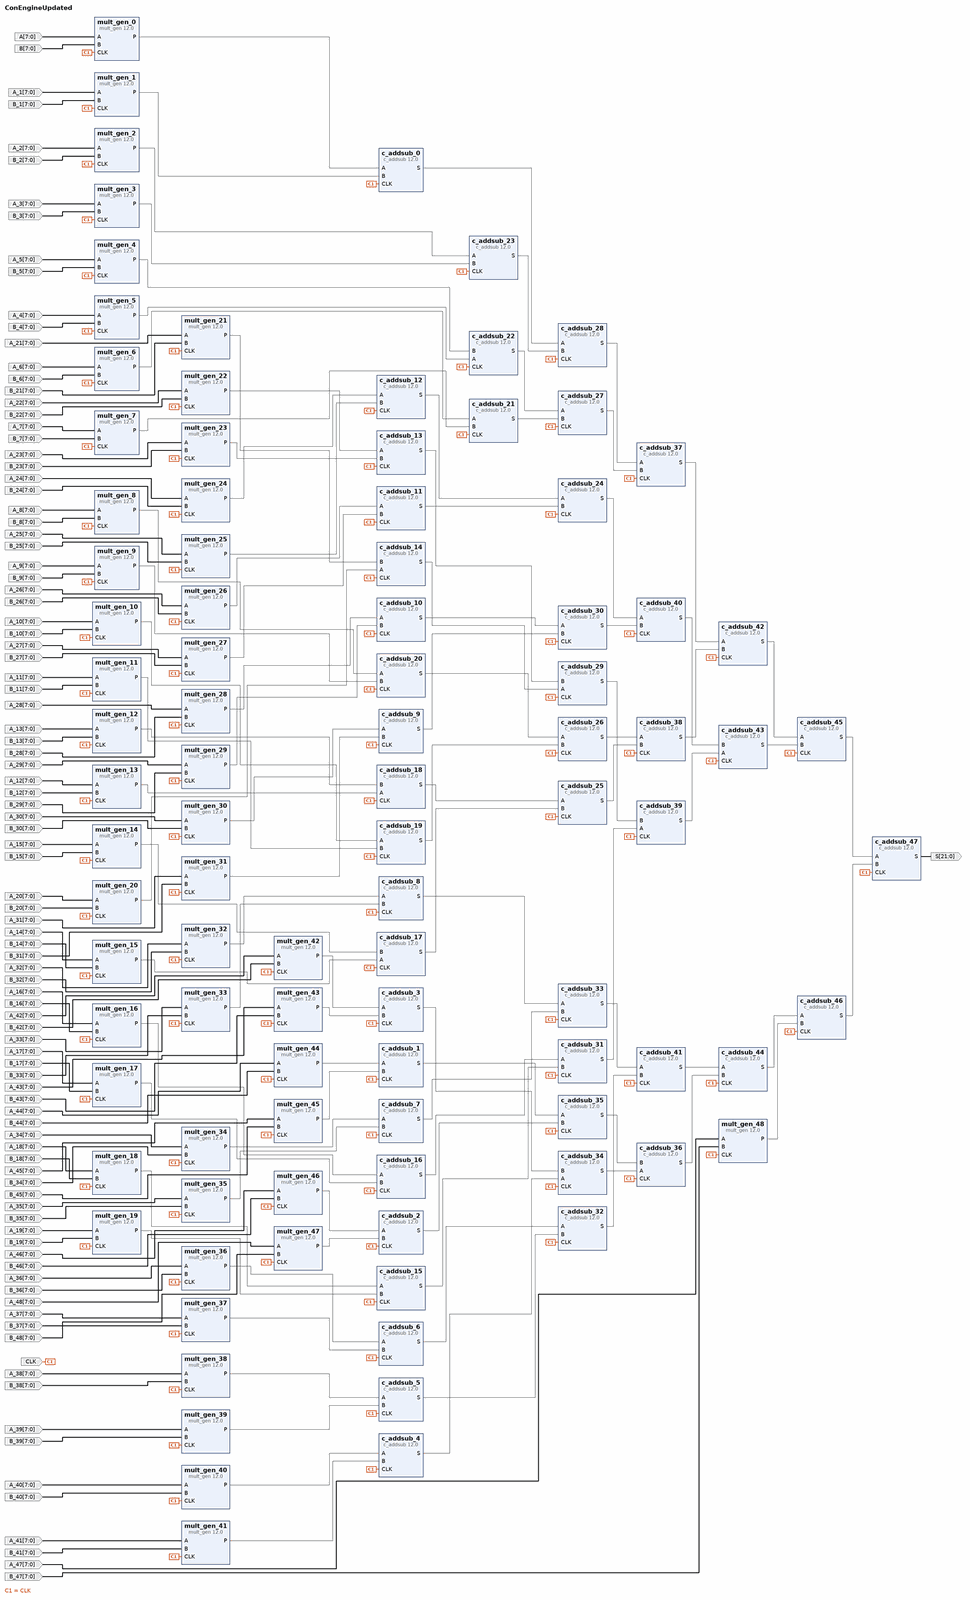
[diagram p0: block diagram of the top level, whole]
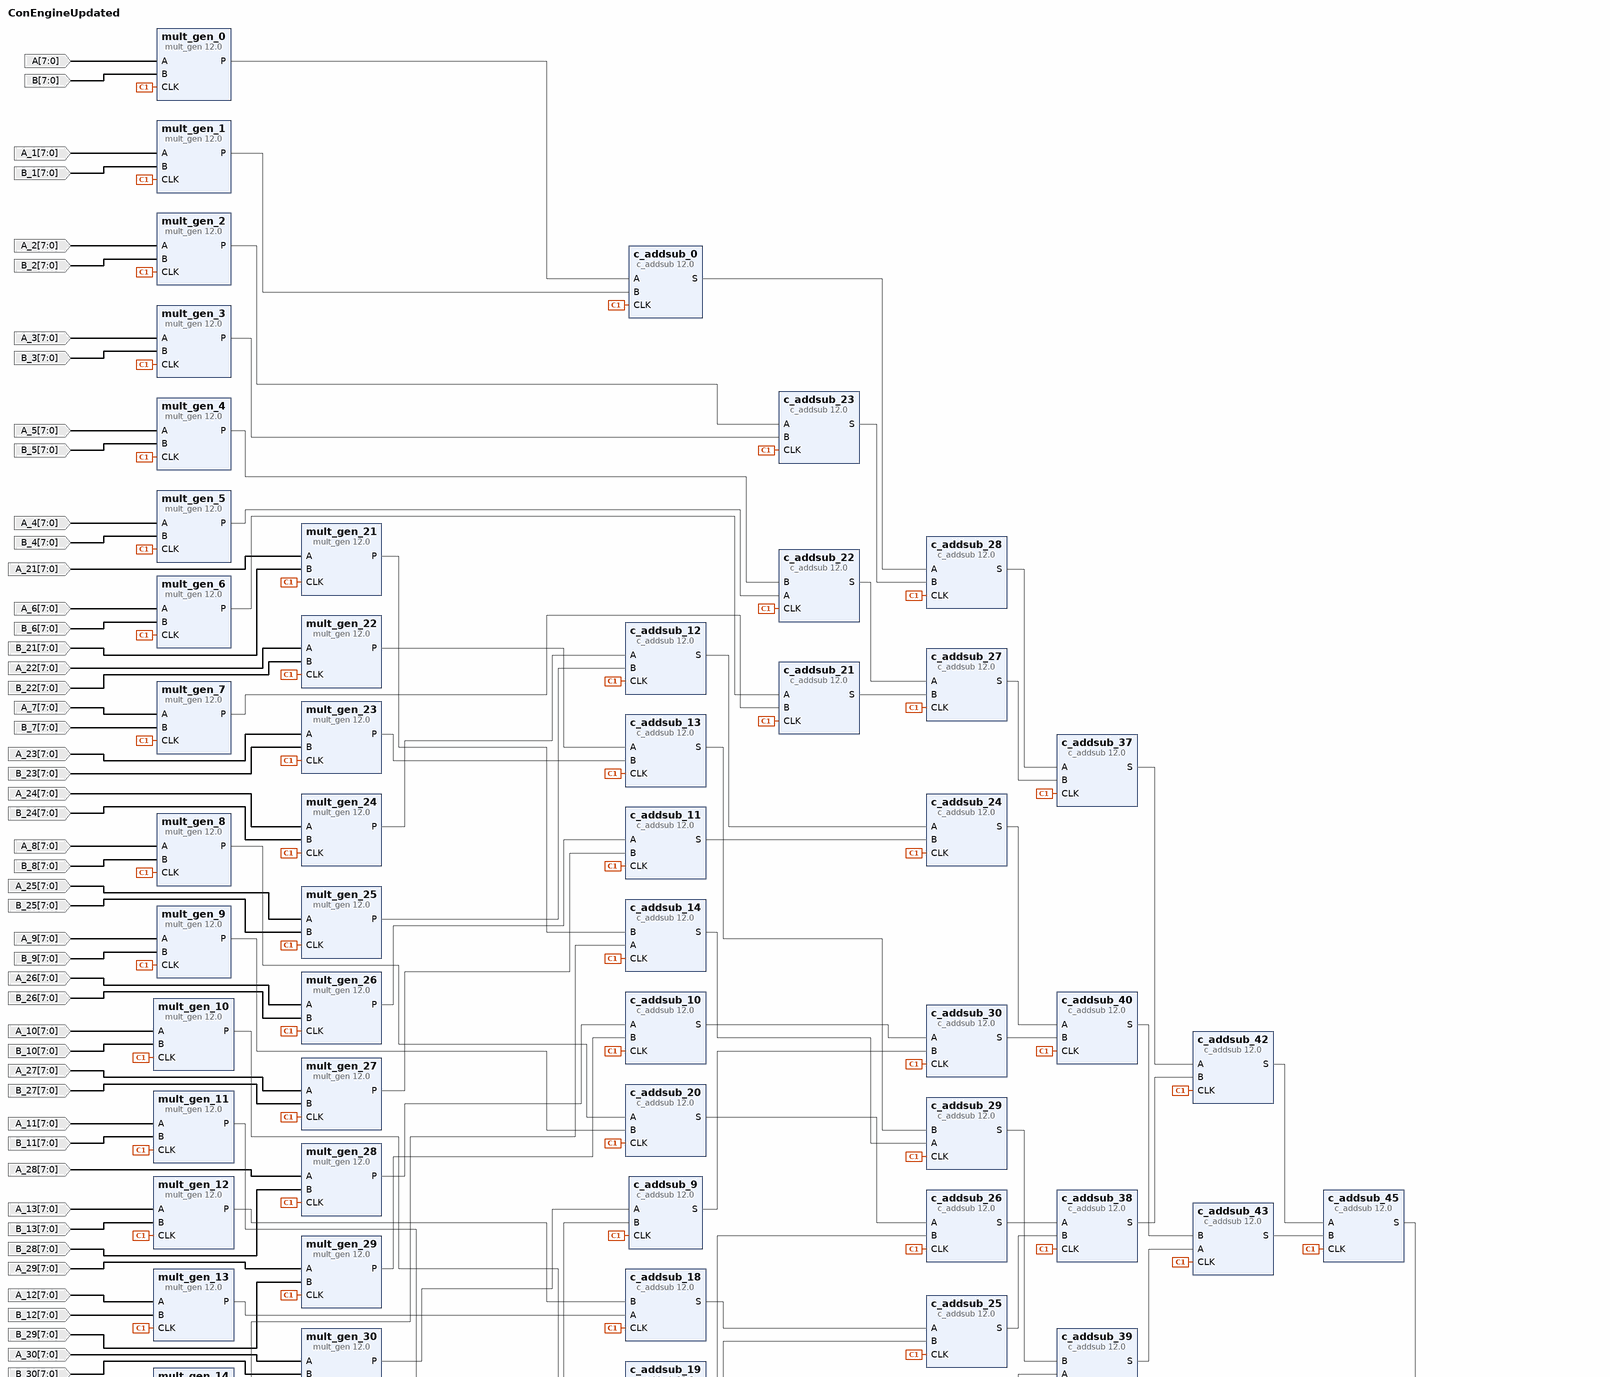
[diagram p1: block diagram of the top level, upper part]
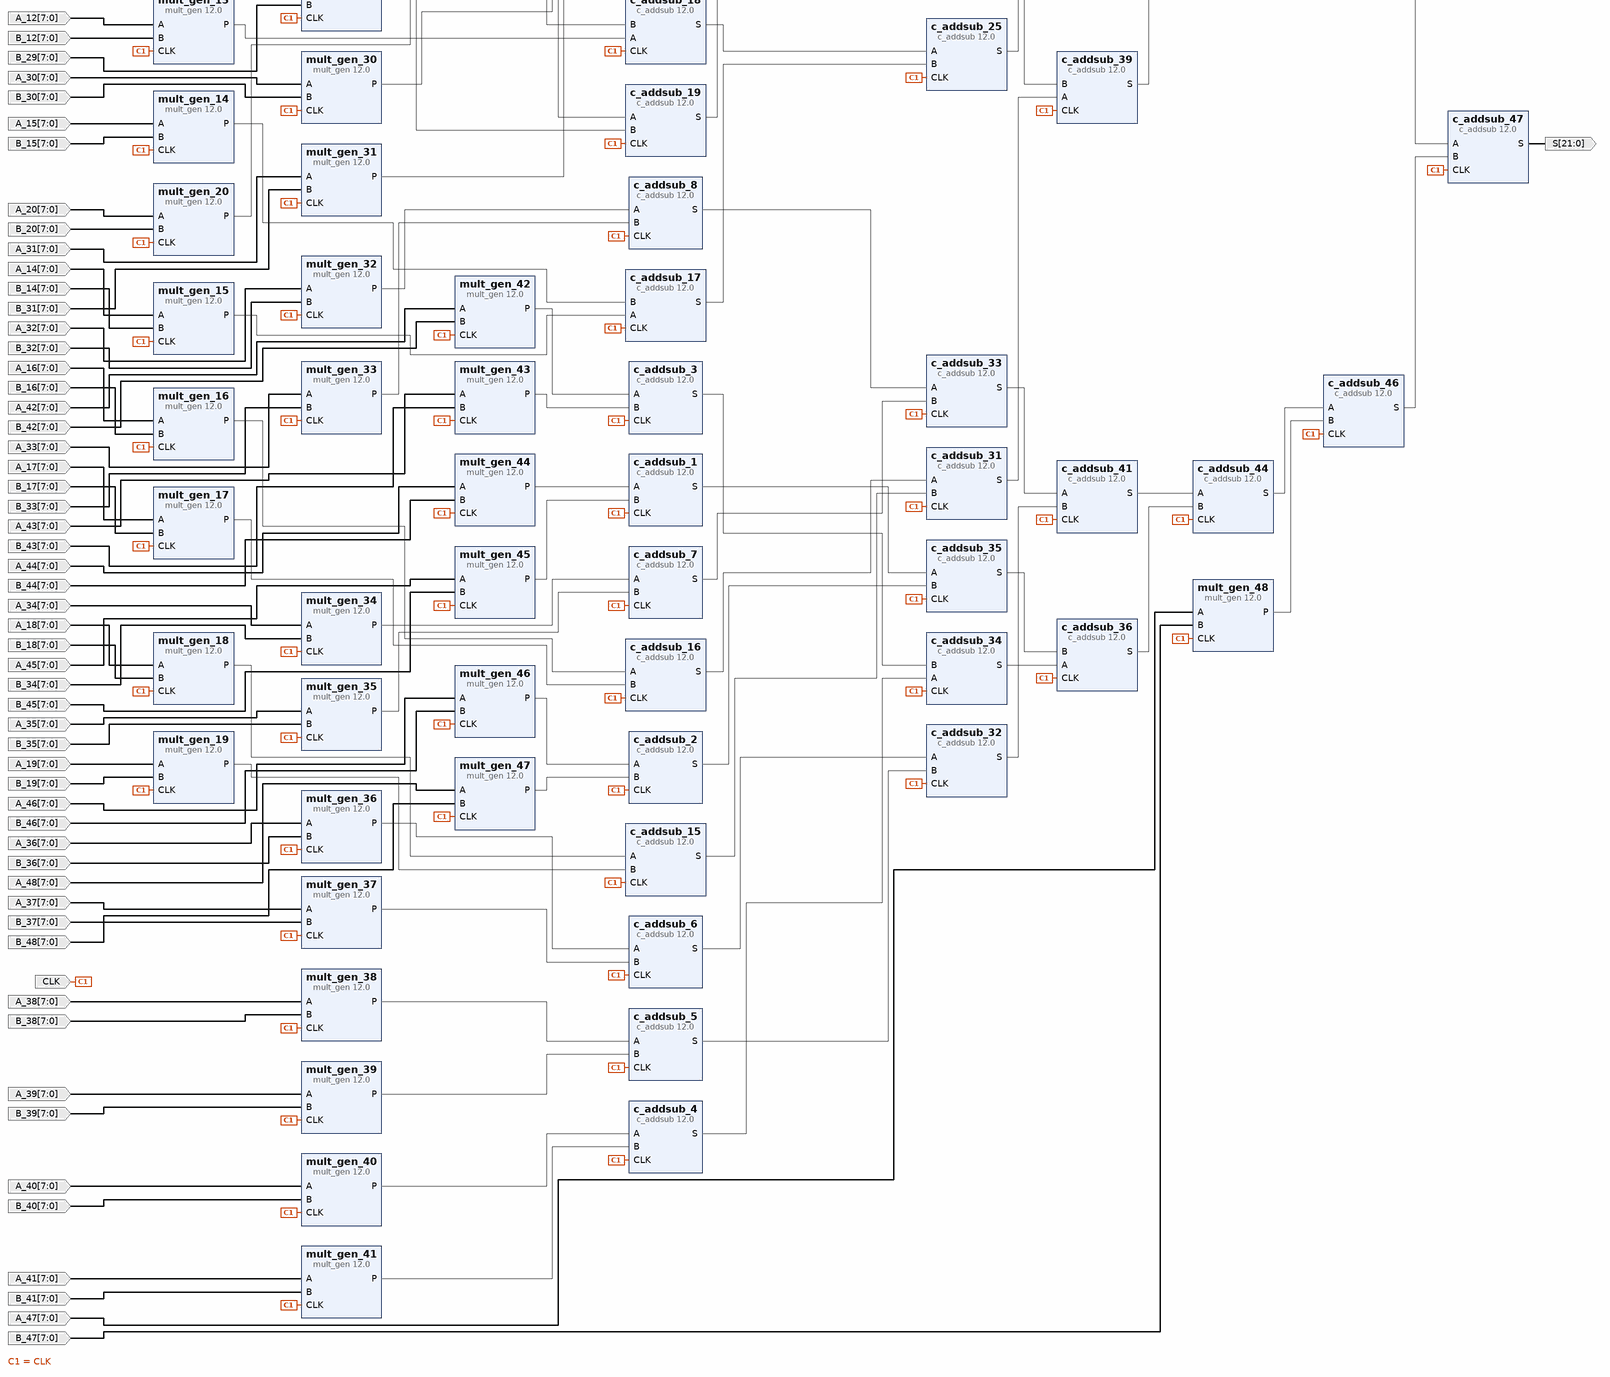
[diagram p2: block diagram of the top level, lower part]
# Vivado block design ConEngineUpdated, xc7z020clg484-1, Vivado 2016.3
create_bd_design ConEngineUpdated

create_bd_port -dir I -from 7 -to 0 -type data A
create_bd_port -dir I -from 7 -to 0 -type data B
create_bd_port -dir I -type clk CLK
set_property -dict {CONFIG.FREQ_HZ 10000000} [get_bd_ports CLK]
create_bd_port -dir I -from 7 -to 0 -type data A_1
create_bd_port -dir I -from 7 -to 0 -type data B_1
create_bd_port -dir I -from 7 -to 0 -type data A_2
create_bd_port -dir I -from 7 -to 0 -type data B_2
create_bd_port -dir I -from 7 -to 0 -type data A_3
create_bd_port -dir I -from 7 -to 0 -type data B_3
create_bd_port -dir I -from 7 -to 0 -type data A_4
create_bd_port -dir I -from 7 -to 0 -type data B_4
create_bd_port -dir I -from 7 -to 0 -type data A_5
create_bd_port -dir I -from 7 -to 0 -type data B_5
create_bd_port -dir I -from 7 -to 0 -type data A_6
create_bd_port -dir I -from 7 -to 0 -type data B_6
create_bd_port -dir I -from 7 -to 0 -type data A_7
create_bd_port -dir I -from 7 -to 0 -type data B_7
create_bd_port -dir I -from 7 -to 0 -type data A_8
create_bd_port -dir I -from 7 -to 0 -type data B_8
create_bd_port -dir I -from 7 -to 0 -type data A_9
create_bd_port -dir I -from 7 -to 0 -type data B_9
create_bd_port -dir I -from 7 -to 0 -type data A_10
create_bd_port -dir I -from 7 -to 0 -type data B_10
create_bd_port -dir I -from 7 -to 0 -type data A_11
create_bd_port -dir I -from 7 -to 0 -type data B_11
create_bd_port -dir I -from 7 -to 0 -type data A_12
create_bd_port -dir I -from 7 -to 0 -type data B_12
create_bd_port -dir I -from 7 -to 0 -type data A_13
create_bd_port -dir I -from 7 -to 0 -type data B_13
create_bd_port -dir I -from 7 -to 0 -type data A_14
create_bd_port -dir I -from 7 -to 0 -type data B_14
create_bd_port -dir I -from 7 -to 0 -type data A_15
create_bd_port -dir I -from 7 -to 0 -type data B_15
create_bd_port -dir I -from 7 -to 0 -type data A_16
create_bd_port -dir I -from 7 -to 0 -type data B_16
create_bd_port -dir I -from 7 -to 0 -type data A_17
create_bd_port -dir I -from 7 -to 0 -type data B_17
create_bd_port -dir I -from 7 -to 0 -type data A_18
create_bd_port -dir I -from 7 -to 0 -type data B_18
create_bd_port -dir I -from 7 -to 0 -type data A_19
create_bd_port -dir I -from 7 -to 0 -type data B_19
create_bd_port -dir I -from 7 -to 0 -type data A_20
create_bd_port -dir I -from 7 -to 0 -type data B_20
create_bd_port -dir I -from 7 -to 0 -type data A_21
create_bd_port -dir I -from 7 -to 0 -type data B_21
create_bd_port -dir I -from 7 -to 0 -type data A_22
create_bd_port -dir I -from 7 -to 0 -type data B_22
create_bd_port -dir I -from 7 -to 0 -type data A_23
create_bd_port -dir I -from 7 -to 0 -type data B_23
create_bd_port -dir I -from 7 -to 0 -type data A_24
create_bd_port -dir I -from 7 -to 0 -type data B_24
create_bd_port -dir I -from 7 -to 0 -type data A_25
create_bd_port -dir I -from 7 -to 0 -type data B_25
create_bd_port -dir I -from 7 -to 0 -type data A_26
create_bd_port -dir I -from 7 -to 0 -type data B_26
create_bd_port -dir I -from 7 -to 0 -type data A_27
create_bd_port -dir I -from 7 -to 0 -type data B_27
create_bd_port -dir I -from 7 -to 0 -type data A_28
create_bd_port -dir I -from 7 -to 0 -type data B_28
create_bd_port -dir I -from 7 -to 0 -type data A_29
create_bd_port -dir I -from 7 -to 0 -type data B_29
create_bd_port -dir I -from 7 -to 0 -type data A_30
create_bd_port -dir I -from 7 -to 0 -type data B_30
create_bd_port -dir I -from 7 -to 0 -type data A_31
create_bd_port -dir I -from 7 -to 0 -type data B_31
create_bd_port -dir I -from 7 -to 0 -type data A_32
create_bd_port -dir I -from 7 -to 0 -type data B_32
create_bd_port -dir I -from 7 -to 0 -type data A_33
create_bd_port -dir I -from 7 -to 0 -type data B_33
create_bd_port -dir I -from 7 -to 0 -type data A_34
create_bd_port -dir I -from 7 -to 0 -type data B_34
create_bd_port -dir I -from 7 -to 0 -type data A_35
create_bd_port -dir I -from 7 -to 0 -type data B_35
create_bd_port -dir I -from 7 -to 0 -type data A_36
create_bd_port -dir I -from 7 -to 0 -type data B_36
create_bd_port -dir I -from 7 -to 0 -type data A_37
create_bd_port -dir I -from 7 -to 0 -type data B_37
create_bd_port -dir I -from 7 -to 0 -type data A_38
create_bd_port -dir I -from 7 -to 0 -type data B_38
create_bd_port -dir I -from 7 -to 0 -type data A_39
create_bd_port -dir I -from 7 -to 0 -type data B_39
create_bd_port -dir I -from 7 -to 0 -type data A_40
create_bd_port -dir I -from 7 -to 0 -type data B_40
create_bd_port -dir I -from 7 -to 0 -type data A_41
create_bd_port -dir I -from 7 -to 0 -type data B_41
create_bd_port -dir I -from 7 -to 0 -type data A_42
create_bd_port -dir I -from 7 -to 0 -type data B_42
create_bd_port -dir I -from 7 -to 0 -type data A_43
create_bd_port -dir I -from 7 -to 0 -type data B_43
create_bd_port -dir I -from 7 -to 0 -type data A_44
create_bd_port -dir I -from 7 -to 0 -type data B_44
create_bd_port -dir I -from 7 -to 0 -type data A_45
create_bd_port -dir I -from 7 -to 0 -type data B_45
create_bd_port -dir I -from 7 -to 0 -type data A_46
create_bd_port -dir I -from 7 -to 0 -type data B_46
create_bd_port -dir I -from 7 -to 0 -type data A_47
create_bd_port -dir I -from 7 -to 0 -type data B_47
create_bd_port -dir O -from 21 -to 0 -type data S
create_bd_port -dir I -from 7 -to 0 -type data A_48
create_bd_port -dir I -from 7 -to 0 -type data B_48

create_bd_cell -type ip -vlnv xilinx.com:ip:mult_gen:12.0 mult_gen_0
set_property -dict {CONFIG.PortAWidth 8 CONFIG.PortBWidth 8 CONFIG.Multiplier_Construction Use_Mults} [get_bd_cells mult_gen_0]
create_bd_cell -type ip -vlnv xilinx.com:ip:mult_gen:12.0 mult_gen_1
set_property -dict {CONFIG.PortAWidth 8 CONFIG.PortBWidth 8 CONFIG.Multiplier_Construction Use_Mults} [get_bd_cells mult_gen_1]
create_bd_cell -type ip -vlnv xilinx.com:ip:mult_gen:12.0 mult_gen_2
set_property -dict {CONFIG.PortAWidth 8 CONFIG.PortBWidth 8 CONFIG.Multiplier_Construction Use_Mults} [get_bd_cells mult_gen_2]
create_bd_cell -type ip -vlnv xilinx.com:ip:mult_gen:12.0 mult_gen_3
set_property -dict {CONFIG.PortAWidth 8 CONFIG.PortBWidth 8 CONFIG.Multiplier_Construction Use_Mults} [get_bd_cells mult_gen_3]
create_bd_cell -type ip -vlnv xilinx.com:ip:mult_gen:12.0 mult_gen_4
set_property -dict {CONFIG.PortAWidth 8 CONFIG.PortBWidth 8 CONFIG.Multiplier_Construction Use_Mults} [get_bd_cells mult_gen_4]
create_bd_cell -type ip -vlnv xilinx.com:ip:mult_gen:12.0 mult_gen_5
set_property -dict {CONFIG.PortAWidth 8 CONFIG.PortBWidth 8 CONFIG.Multiplier_Construction Use_Mults} [get_bd_cells mult_gen_5]
create_bd_cell -type ip -vlnv xilinx.com:ip:mult_gen:12.0 mult_gen_6
set_property -dict {CONFIG.PortAWidth 8 CONFIG.PortBWidth 8 CONFIG.Multiplier_Construction Use_Mults} [get_bd_cells mult_gen_6]
create_bd_cell -type ip -vlnv xilinx.com:ip:mult_gen:12.0 mult_gen_7
set_property -dict {CONFIG.PortAWidth 8 CONFIG.PortBWidth 8 CONFIG.Multiplier_Construction Use_Mults} [get_bd_cells mult_gen_7]
create_bd_cell -type ip -vlnv xilinx.com:ip:mult_gen:12.0 mult_gen_8
set_property -dict {CONFIG.PortAWidth 8 CONFIG.PortBWidth 8 CONFIG.Multiplier_Construction Use_Mults} [get_bd_cells mult_gen_8]
create_bd_cell -type ip -vlnv xilinx.com:ip:mult_gen:12.0 mult_gen_9
set_property -dict {CONFIG.PortAWidth 8 CONFIG.PortBWidth 8 CONFIG.Multiplier_Construction Use_Mults} [get_bd_cells mult_gen_9]
create_bd_cell -type ip -vlnv xilinx.com:ip:mult_gen:12.0 mult_gen_10
set_property -dict {CONFIG.PortAWidth 8 CONFIG.PortBWidth 8 CONFIG.Multiplier_Construction Use_Mults} [get_bd_cells mult_gen_10]
create_bd_cell -type ip -vlnv xilinx.com:ip:mult_gen:12.0 mult_gen_11
set_property -dict {CONFIG.PortAWidth 8 CONFIG.PortBWidth 8 CONFIG.Multiplier_Construction Use_Mults} [get_bd_cells mult_gen_11]
create_bd_cell -type ip -vlnv xilinx.com:ip:mult_gen:12.0 mult_gen_12
set_property -dict {CONFIG.PortAWidth 8 CONFIG.PortBWidth 8 CONFIG.Multiplier_Construction Use_Mults} [get_bd_cells mult_gen_12]
create_bd_cell -type ip -vlnv xilinx.com:ip:mult_gen:12.0 mult_gen_13
set_property -dict {CONFIG.PortAWidth 8 CONFIG.PortBWidth 8 CONFIG.Multiplier_Construction Use_Mults} [get_bd_cells mult_gen_13]
create_bd_cell -type ip -vlnv xilinx.com:ip:mult_gen:12.0 mult_gen_14
set_property -dict {CONFIG.PortAWidth 8 CONFIG.PortBWidth 8 CONFIG.Multiplier_Construction Use_Mults} [get_bd_cells mult_gen_14]
create_bd_cell -type ip -vlnv xilinx.com:ip:mult_gen:12.0 mult_gen_15
set_property -dict {CONFIG.PortAWidth 8 CONFIG.PortBWidth 8 CONFIG.Multiplier_Construction Use_Mults} [get_bd_cells mult_gen_15]
create_bd_cell -type ip -vlnv xilinx.com:ip:mult_gen:12.0 mult_gen_16
set_property -dict {CONFIG.PortAWidth 8 CONFIG.PortBWidth 8 CONFIG.Multiplier_Construction Use_Mults} [get_bd_cells mult_gen_16]
create_bd_cell -type ip -vlnv xilinx.com:ip:mult_gen:12.0 mult_gen_17
set_property -dict {CONFIG.PortAWidth 8 CONFIG.PortBWidth 8 CONFIG.Multiplier_Construction Use_Mults} [get_bd_cells mult_gen_17]
create_bd_cell -type ip -vlnv xilinx.com:ip:mult_gen:12.0 mult_gen_18
set_property -dict {CONFIG.PortAWidth 8 CONFIG.PortBWidth 8 CONFIG.Multiplier_Construction Use_Mults} [get_bd_cells mult_gen_18]
create_bd_cell -type ip -vlnv xilinx.com:ip:mult_gen:12.0 mult_gen_19
set_property -dict {CONFIG.PortAWidth 8 CONFIG.PortBWidth 8 CONFIG.Multiplier_Construction Use_Mults} [get_bd_cells mult_gen_19]
create_bd_cell -type ip -vlnv xilinx.com:ip:mult_gen:12.0 mult_gen_20
set_property -dict {CONFIG.PortAWidth 8 CONFIG.PortBWidth 8 CONFIG.Multiplier_Construction Use_Mults} [get_bd_cells mult_gen_20]
create_bd_cell -type ip -vlnv xilinx.com:ip:mult_gen:12.0 mult_gen_21
set_property -dict {CONFIG.PortAWidth 8 CONFIG.PortBWidth 8 CONFIG.Multiplier_Construction Use_Mults} [get_bd_cells mult_gen_21]
create_bd_cell -type ip -vlnv xilinx.com:ip:mult_gen:12.0 mult_gen_22
set_property -dict {CONFIG.PortAWidth 8 CONFIG.PortBWidth 8 CONFIG.Multiplier_Construction Use_Mults} [get_bd_cells mult_gen_22]
create_bd_cell -type ip -vlnv xilinx.com:ip:mult_gen:12.0 mult_gen_23
set_property -dict {CONFIG.PortAWidth 8 CONFIG.PortBWidth 8 CONFIG.Multiplier_Construction Use_Mults} [get_bd_cells mult_gen_23]
create_bd_cell -type ip -vlnv xilinx.com:ip:mult_gen:12.0 mult_gen_24
set_property -dict {CONFIG.PortAWidth 8 CONFIG.PortBWidth 8 CONFIG.Multiplier_Construction Use_Mults} [get_bd_cells mult_gen_24]
create_bd_cell -type ip -vlnv xilinx.com:ip:mult_gen:12.0 mult_gen_25
set_property -dict {CONFIG.PortAWidth 8 CONFIG.PortBWidth 8 CONFIG.Multiplier_Construction Use_Mults} [get_bd_cells mult_gen_25]
create_bd_cell -type ip -vlnv xilinx.com:ip:mult_gen:12.0 mult_gen_26
set_property -dict {CONFIG.PortAWidth 8 CONFIG.PortBWidth 8 CONFIG.Multiplier_Construction Use_Mults} [get_bd_cells mult_gen_26]
create_bd_cell -type ip -vlnv xilinx.com:ip:mult_gen:12.0 mult_gen_27
set_property -dict {CONFIG.PortAWidth 8 CONFIG.PortBWidth 8 CONFIG.Multiplier_Construction Use_Mults} [get_bd_cells mult_gen_27]
create_bd_cell -type ip -vlnv xilinx.com:ip:mult_gen:12.0 mult_gen_28
set_property -dict {CONFIG.PortAWidth 8 CONFIG.PortBWidth 8 CONFIG.Multiplier_Construction Use_Mults} [get_bd_cells mult_gen_28]
create_bd_cell -type ip -vlnv xilinx.com:ip:mult_gen:12.0 mult_gen_29
set_property -dict {CONFIG.PortAWidth 8 CONFIG.PortBWidth 8 CONFIG.Multiplier_Construction Use_Mults} [get_bd_cells mult_gen_29]
create_bd_cell -type ip -vlnv xilinx.com:ip:mult_gen:12.0 mult_gen_30
set_property -dict {CONFIG.PortAWidth 8 CONFIG.PortBWidth 8 CONFIG.Multiplier_Construction Use_Mults} [get_bd_cells mult_gen_30]
create_bd_cell -type ip -vlnv xilinx.com:ip:mult_gen:12.0 mult_gen_31
set_property -dict {CONFIG.PortAWidth 8 CONFIG.PortBWidth 8 CONFIG.Multiplier_Construction Use_Mults} [get_bd_cells mult_gen_31]
create_bd_cell -type ip -vlnv xilinx.com:ip:mult_gen:12.0 mult_gen_32
set_property -dict {CONFIG.PortAWidth 8 CONFIG.PortBWidth 8 CONFIG.Multiplier_Construction Use_Mults} [get_bd_cells mult_gen_32]
create_bd_cell -type ip -vlnv xilinx.com:ip:mult_gen:12.0 mult_gen_33
set_property -dict {CONFIG.PortAWidth 8 CONFIG.PortBWidth 8 CONFIG.Multiplier_Construction Use_Mults} [get_bd_cells mult_gen_33]
create_bd_cell -type ip -vlnv xilinx.com:ip:mult_gen:12.0 mult_gen_34
set_property -dict {CONFIG.PortAWidth 8 CONFIG.PortBWidth 8 CONFIG.Multiplier_Construction Use_Mults} [get_bd_cells mult_gen_34]
create_bd_cell -type ip -vlnv xilinx.com:ip:mult_gen:12.0 mult_gen_35
set_property -dict {CONFIG.PortAWidth 8 CONFIG.PortBWidth 8 CONFIG.Multiplier_Construction Use_Mults} [get_bd_cells mult_gen_35]
create_bd_cell -type ip -vlnv xilinx.com:ip:mult_gen:12.0 mult_gen_36
set_property -dict {CONFIG.PortAWidth 8 CONFIG.PortBWidth 8 CONFIG.Multiplier_Construction Use_Mults} [get_bd_cells mult_gen_36]
create_bd_cell -type ip -vlnv xilinx.com:ip:mult_gen:12.0 mult_gen_37
set_property -dict {CONFIG.PortAWidth 8 CONFIG.PortBWidth 8 CONFIG.Multiplier_Construction Use_Mults} [get_bd_cells mult_gen_37]
create_bd_cell -type ip -vlnv xilinx.com:ip:mult_gen:12.0 mult_gen_38
set_property -dict {CONFIG.PortAWidth 8 CONFIG.PortBWidth 8 CONFIG.Multiplier_Construction Use_Mults} [get_bd_cells mult_gen_38]
create_bd_cell -type ip -vlnv xilinx.com:ip:mult_gen:12.0 mult_gen_39
set_property -dict {CONFIG.PortAWidth 8 CONFIG.PortBWidth 8 CONFIG.Multiplier_Construction Use_Mults} [get_bd_cells mult_gen_39]
create_bd_cell -type ip -vlnv xilinx.com:ip:mult_gen:12.0 mult_gen_40
set_property -dict {CONFIG.PortAWidth 8 CONFIG.PortBWidth 8 CONFIG.Multiplier_Construction Use_Mults} [get_bd_cells mult_gen_40]
create_bd_cell -type ip -vlnv xilinx.com:ip:mult_gen:12.0 mult_gen_41
set_property -dict {CONFIG.PortAWidth 8 CONFIG.PortBWidth 8 CONFIG.Multiplier_Construction Use_Mults} [get_bd_cells mult_gen_41]
create_bd_cell -type ip -vlnv xilinx.com:ip:mult_gen:12.0 mult_gen_42
set_property -dict {CONFIG.PortAWidth 8 CONFIG.PortBWidth 8 CONFIG.Multiplier_Construction Use_Mults} [get_bd_cells mult_gen_42]
create_bd_cell -type ip -vlnv xilinx.com:ip:mult_gen:12.0 mult_gen_43
set_property -dict {CONFIG.PortAWidth 8 CONFIG.PortBWidth 8 CONFIG.Multiplier_Construction Use_Mults} [get_bd_cells mult_gen_43]
create_bd_cell -type ip -vlnv xilinx.com:ip:mult_gen:12.0 mult_gen_44
set_property -dict {CONFIG.PortAWidth 8 CONFIG.PortBWidth 8 CONFIG.Multiplier_Construction Use_Mults} [get_bd_cells mult_gen_44]
create_bd_cell -type ip -vlnv xilinx.com:ip:mult_gen:12.0 mult_gen_45
set_property -dict {CONFIG.PortAWidth 8 CONFIG.PortBWidth 8 CONFIG.Multiplier_Construction Use_Mults} [get_bd_cells mult_gen_45]
create_bd_cell -type ip -vlnv xilinx.com:ip:mult_gen:12.0 mult_gen_46
set_property -dict {CONFIG.PortAWidth 8 CONFIG.PortBWidth 8 CONFIG.Multiplier_Construction Use_Mults} [get_bd_cells mult_gen_46]
create_bd_cell -type ip -vlnv xilinx.com:ip:mult_gen:12.0 mult_gen_47
set_property -dict {CONFIG.PortAWidth 8 CONFIG.PortBWidth 8 CONFIG.Multiplier_Construction Use_Mults} [get_bd_cells mult_gen_47]
create_bd_cell -type ip -vlnv xilinx.com:ip:mult_gen:12.0 mult_gen_48
set_property -dict {CONFIG.PortAWidth 8 CONFIG.PortBWidth 8 CONFIG.Multiplier_Construction Use_Mults} [get_bd_cells mult_gen_48]
create_bd_cell -type ip -vlnv xilinx.com:ip:c_addsub:12.0 c_addsub_0
set_property -dict [list \
  CONFIG.A_Width 16 \
  CONFIG.B_Width 16 \
  CONFIG.Out_Width 17 \
  CONFIG.Latency 1 \
  CONFIG.B_Value 0000000000000000 \
  CONFIG.CE false \
] [get_bd_cells c_addsub_0]
create_bd_cell -type ip -vlnv xilinx.com:ip:c_addsub:12.0 c_addsub_1
set_property -dict [list \
  CONFIG.A_Width 16 \
  CONFIG.B_Width 16 \
  CONFIG.Out_Width 17 \
  CONFIG.Latency 1 \
  CONFIG.B_Value 0000000000000000 \
  CONFIG.CE false \
] [get_bd_cells c_addsub_1]
create_bd_cell -type ip -vlnv xilinx.com:ip:c_addsub:12.0 c_addsub_2
set_property -dict [list \
  CONFIG.A_Width 16 \
  CONFIG.B_Width 16 \
  CONFIG.Out_Width 17 \
  CONFIG.Latency 1 \
  CONFIG.B_Value 0000000000000000 \
  CONFIG.CE false \
] [get_bd_cells c_addsub_2]
create_bd_cell -type ip -vlnv xilinx.com:ip:c_addsub:12.0 c_addsub_3
set_property -dict [list \
  CONFIG.A_Width 16 \
  CONFIG.B_Width 16 \
  CONFIG.Out_Width 17 \
  CONFIG.Latency 1 \
  CONFIG.B_Value 0000000000000000 \
  CONFIG.CE false \
] [get_bd_cells c_addsub_3]
create_bd_cell -type ip -vlnv xilinx.com:ip:c_addsub:12.0 c_addsub_4
set_property -dict [list \
  CONFIG.A_Width 16 \
  CONFIG.B_Width 16 \
  CONFIG.Out_Width 17 \
  CONFIG.Latency 1 \
  CONFIG.B_Value 0000000000000000 \
  CONFIG.CE false \
] [get_bd_cells c_addsub_4]
create_bd_cell -type ip -vlnv xilinx.com:ip:c_addsub:12.0 c_addsub_5
set_property -dict [list \
  CONFIG.A_Width 16 \
  CONFIG.B_Width 16 \
  CONFIG.Out_Width 17 \
  CONFIG.Latency 1 \
  CONFIG.B_Value 0000000000000000 \
  CONFIG.CE false \
] [get_bd_cells c_addsub_5]
create_bd_cell -type ip -vlnv xilinx.com:ip:c_addsub:12.0 c_addsub_6
set_property -dict [list \
  CONFIG.A_Width 16 \
  CONFIG.B_Width 16 \
  CONFIG.Out_Width 17 \
  CONFIG.Latency 1 \
  CONFIG.B_Value 0000000000000000 \
  CONFIG.CE false \
] [get_bd_cells c_addsub_6]
create_bd_cell -type ip -vlnv xilinx.com:ip:c_addsub:12.0 c_addsub_7
set_property -dict [list \
  CONFIG.A_Width 16 \
  CONFIG.B_Width 16 \
  CONFIG.Out_Width 17 \
  CONFIG.Latency 1 \
  CONFIG.B_Value 0000000000000000 \
  CONFIG.CE false \
] [get_bd_cells c_addsub_7]
create_bd_cell -type ip -vlnv xilinx.com:ip:c_addsub:12.0 c_addsub_8
set_property -dict [list \
  CONFIG.A_Width 16 \
  CONFIG.B_Width 16 \
  CONFIG.Out_Width 17 \
  CONFIG.Latency 1 \
  CONFIG.B_Value 0000000000000000 \
  CONFIG.CE false \
] [get_bd_cells c_addsub_8]
create_bd_cell -type ip -vlnv xilinx.com:ip:c_addsub:12.0 c_addsub_9
set_property -dict [list \
  CONFIG.A_Width 16 \
  CONFIG.B_Width 16 \
  CONFIG.Out_Width 17 \
  CONFIG.Latency 1 \
  CONFIG.B_Value 0000000000000000 \
  CONFIG.CE false \
] [get_bd_cells c_addsub_9]
create_bd_cell -type ip -vlnv xilinx.com:ip:c_addsub:12.0 c_addsub_10
set_property -dict [list \
  CONFIG.A_Width 16 \
  CONFIG.B_Width 16 \
  CONFIG.Out_Width 17 \
  CONFIG.Latency 1 \
  CONFIG.B_Value 0000000000000000 \
  CONFIG.CE false \
] [get_bd_cells c_addsub_10]
create_bd_cell -type ip -vlnv xilinx.com:ip:c_addsub:12.0 c_addsub_11
set_property -dict [list \
  CONFIG.A_Width 16 \
  CONFIG.B_Width 16 \
  CONFIG.Out_Width 17 \
  CONFIG.Latency 1 \
  CONFIG.B_Value 0000000000000000 \
  CONFIG.CE false \
] [get_bd_cells c_addsub_11]
create_bd_cell -type ip -vlnv xilinx.com:ip:c_addsub:12.0 c_addsub_12
set_property -dict [list \
  CONFIG.A_Width 16 \
  CONFIG.B_Width 16 \
  CONFIG.Out_Width 17 \
  CONFIG.Latency 1 \
  CONFIG.B_Value 0000000000000000 \
  CONFIG.CE false \
] [get_bd_cells c_addsub_12]
create_bd_cell -type ip -vlnv xilinx.com:ip:c_addsub:12.0 c_addsub_13
set_property -dict [list \
  CONFIG.A_Width 16 \
  CONFIG.B_Width 16 \
  CONFIG.Out_Width 17 \
  CONFIG.Latency 1 \
  CONFIG.B_Value 0000000000000000 \
  CONFIG.CE false \
] [get_bd_cells c_addsub_13]
create_bd_cell -type ip -vlnv xilinx.com:ip:c_addsub:12.0 c_addsub_14
set_property -dict [list \
  CONFIG.A_Width 16 \
  CONFIG.B_Width 16 \
  CONFIG.Out_Width 17 \
  CONFIG.Latency 1 \
  CONFIG.B_Value 0000000000000000 \
  CONFIG.CE false \
] [get_bd_cells c_addsub_14]
create_bd_cell -type ip -vlnv xilinx.com:ip:c_addsub:12.0 c_addsub_15
set_property -dict [list \
  CONFIG.A_Width 16 \
  CONFIG.B_Width 16 \
  CONFIG.Out_Width 17 \
  CONFIG.Latency 1 \
  CONFIG.B_Value 0000000000000000 \
  CONFIG.CE false \
] [get_bd_cells c_addsub_15]
create_bd_cell -type ip -vlnv xilinx.com:ip:c_addsub:12.0 c_addsub_16
set_property -dict [list \
  CONFIG.A_Width 16 \
  CONFIG.B_Width 16 \
  CONFIG.Out_Width 17 \
  CONFIG.Latency 1 \
  CONFIG.B_Value 0000000000000000 \
  CONFIG.CE false \
] [get_bd_cells c_addsub_16]
create_bd_cell -type ip -vlnv xilinx.com:ip:c_addsub:12.0 c_addsub_17
set_property -dict [list \
  CONFIG.A_Width 16 \
  CONFIG.B_Width 16 \
  CONFIG.Out_Width 17 \
  CONFIG.Latency 1 \
  CONFIG.B_Value 0000000000000000 \
  CONFIG.CE false \
] [get_bd_cells c_addsub_17]
create_bd_cell -type ip -vlnv xilinx.com:ip:c_addsub:12.0 c_addsub_18
set_property -dict [list \
  CONFIG.A_Width 16 \
  CONFIG.B_Width 16 \
  CONFIG.Out_Width 17 \
  CONFIG.Latency 1 \
  CONFIG.B_Value 0000000000000000 \
  CONFIG.CE false \
] [get_bd_cells c_addsub_18]
create_bd_cell -type ip -vlnv xilinx.com:ip:c_addsub:12.0 c_addsub_19
set_property -dict [list \
  CONFIG.A_Width 16 \
  CONFIG.B_Width 16 \
  CONFIG.Out_Width 17 \
  CONFIG.Latency 1 \
  CONFIG.B_Value 0000000000000000 \
  CONFIG.CE false \
] [get_bd_cells c_addsub_19]
create_bd_cell -type ip -vlnv xilinx.com:ip:c_addsub:12.0 c_addsub_20
set_property -dict [list \
  CONFIG.A_Width 16 \
  CONFIG.B_Width 16 \
  CONFIG.Out_Width 17 \
  CONFIG.Latency 1 \
  CONFIG.B_Value 0000000000000000 \
  CONFIG.CE false \
] [get_bd_cells c_addsub_20]
create_bd_cell -type ip -vlnv xilinx.com:ip:c_addsub:12.0 c_addsub_21
set_property -dict [list \
  CONFIG.A_Width 16 \
  CONFIG.B_Width 16 \
  CONFIG.Out_Width 17 \
  CONFIG.Latency 1 \
  CONFIG.B_Value 0000000000000000 \
  CONFIG.CE false \
] [get_bd_cells c_addsub_21]
create_bd_cell -type ip -vlnv xilinx.com:ip:c_addsub:12.0 c_addsub_22
set_property -dict [list \
  CONFIG.A_Width 16 \
  CONFIG.B_Width 16 \
  CONFIG.Out_Width 17 \
  CONFIG.Latency 1 \
  CONFIG.B_Value 0000000000000000 \
  CONFIG.CE false \
] [get_bd_cells c_addsub_22]
create_bd_cell -type ip -vlnv xilinx.com:ip:c_addsub:12.0 c_addsub_23
set_property -dict [list \
  CONFIG.A_Width 16 \
  CONFIG.B_Width 16 \
  CONFIG.Out_Width 17 \
  CONFIG.Latency 1 \
  CONFIG.B_Value 0000000000000000 \
  CONFIG.CE false \
] [get_bd_cells c_addsub_23]
create_bd_cell -type ip -vlnv xilinx.com:ip:c_addsub:12.0 c_addsub_24
set_property -dict [list \
  CONFIG.A_Width 17 \
  CONFIG.B_Width 17 \
  CONFIG.Out_Width 18 \
  CONFIG.Latency 1 \
  CONFIG.B_Value 00000000000000000 \
  CONFIG.CE false \
] [get_bd_cells c_addsub_24]
create_bd_cell -type ip -vlnv xilinx.com:ip:c_addsub:12.0 c_addsub_25
set_property -dict [list \
  CONFIG.A_Width 17 \
  CONFIG.B_Width 17 \
  CONFIG.Out_Width 18 \
  CONFIG.Latency 1 \
  CONFIG.B_Value 00000000000000000 \
  CONFIG.CE false \
] [get_bd_cells c_addsub_25]
create_bd_cell -type ip -vlnv xilinx.com:ip:c_addsub:12.0 c_addsub_26
set_property -dict [list \
  CONFIG.A_Width 17 \
  CONFIG.B_Width 17 \
  CONFIG.Out_Width 18 \
  CONFIG.Latency 1 \
  CONFIG.B_Value 00000000000000000 \
  CONFIG.CE false \
] [get_bd_cells c_addsub_26]
create_bd_cell -type ip -vlnv xilinx.com:ip:c_addsub:12.0 c_addsub_27
set_property -dict [list \
  CONFIG.A_Width 17 \
  CONFIG.B_Width 17 \
  CONFIG.Out_Width 18 \
  CONFIG.Latency 1 \
  CONFIG.B_Value 00000000000000000 \
  CONFIG.CE false \
] [get_bd_cells c_addsub_27]
create_bd_cell -type ip -vlnv xilinx.com:ip:c_addsub:12.0 c_addsub_28
set_property -dict [list \
  CONFIG.A_Width 17 \
  CONFIG.B_Width 17 \
  CONFIG.Out_Width 18 \
  CONFIG.Latency 1 \
  CONFIG.B_Value 00000000000000000 \
  CONFIG.CE false \
] [get_bd_cells c_addsub_28]
create_bd_cell -type ip -vlnv xilinx.com:ip:c_addsub:12.0 c_addsub_29
set_property -dict [list \
  CONFIG.A_Width 17 \
  CONFIG.B_Width 17 \
  CONFIG.Out_Width 18 \
  CONFIG.Latency 1 \
  CONFIG.B_Value 00000000000000000 \
  CONFIG.CE false \
] [get_bd_cells c_addsub_29]
create_bd_cell -type ip -vlnv xilinx.com:ip:c_addsub:12.0 c_addsub_30
set_property -dict [list \
  CONFIG.A_Width 17 \
  CONFIG.B_Width 17 \
  CONFIG.Out_Width 18 \
  CONFIG.Latency 1 \
  CONFIG.B_Value 00000000000000000 \
  CONFIG.CE false \
] [get_bd_cells c_addsub_30]
create_bd_cell -type ip -vlnv xilinx.com:ip:c_addsub:12.0 c_addsub_31
set_property -dict [list \
  CONFIG.A_Width 17 \
  CONFIG.B_Width 17 \
  CONFIG.Out_Width 18 \
  CONFIG.Latency 1 \
  CONFIG.B_Value 00000000000000000 \
  CONFIG.CE false \
] [get_bd_cells c_addsub_31]
create_bd_cell -type ip -vlnv xilinx.com:ip:c_addsub:12.0 c_addsub_32
set_property -dict [list \
  CONFIG.A_Width 17 \
  CONFIG.B_Width 17 \
  CONFIG.Out_Width 18 \
  CONFIG.Latency 1 \
  CONFIG.B_Value 00000000000000000 \
  CONFIG.CE false \
] [get_bd_cells c_addsub_32]
create_bd_cell -type ip -vlnv xilinx.com:ip:c_addsub:12.0 c_addsub_33
set_property -dict [list \
  CONFIG.A_Width 17 \
  CONFIG.B_Width 17 \
  CONFIG.Out_Width 18 \
  CONFIG.Latency 1 \
  CONFIG.B_Value 00000000000000000 \
  CONFIG.CE false \
] [get_bd_cells c_addsub_33]
create_bd_cell -type ip -vlnv xilinx.com:ip:c_addsub:12.0 c_addsub_34
set_property -dict [list \
  CONFIG.A_Width 17 \
  CONFIG.B_Width 17 \
  CONFIG.Out_Width 18 \
  CONFIG.Latency 1 \
  CONFIG.B_Value 00000000000000000 \
  CONFIG.CE false \
] [get_bd_cells c_addsub_34]
create_bd_cell -type ip -vlnv xilinx.com:ip:c_addsub:12.0 c_addsub_35
set_property -dict [list \
  CONFIG.A_Width 17 \
  CONFIG.B_Width 17 \
  CONFIG.Out_Width 18 \
  CONFIG.Latency 1 \
  CONFIG.B_Value 00000000000000000 \
  CONFIG.CE false \
] [get_bd_cells c_addsub_35]
create_bd_cell -type ip -vlnv xilinx.com:ip:c_addsub:12.0 c_addsub_36
set_property -dict [list \
  CONFIG.A_Width 18 \
  CONFIG.B_Width 18 \
  CONFIG.Out_Width 19 \
  CONFIG.Latency 1 \
  CONFIG.B_Value 000000000000000000 \
  CONFIG.CE false \
] [get_bd_cells c_addsub_36]
create_bd_cell -type ip -vlnv xilinx.com:ip:c_addsub:12.0 c_addsub_37
set_property -dict [list \
  CONFIG.A_Width 18 \
  CONFIG.B_Width 18 \
  CONFIG.Out_Width 19 \
  CONFIG.Latency 1 \
  CONFIG.B_Value 000000000000000000 \
  CONFIG.CE false \
] [get_bd_cells c_addsub_37]
create_bd_cell -type ip -vlnv xilinx.com:ip:c_addsub:12.0 c_addsub_38
set_property -dict [list \
  CONFIG.A_Width 18 \
  CONFIG.B_Width 18 \
  CONFIG.Out_Width 19 \
  CONFIG.Latency 1 \
  CONFIG.B_Value 000000000000000000 \
  CONFIG.CE false \
] [get_bd_cells c_addsub_38]
create_bd_cell -type ip -vlnv xilinx.com:ip:c_addsub:12.0 c_addsub_39
set_property -dict [list \
  CONFIG.A_Width 18 \
  CONFIG.B_Width 18 \
  CONFIG.Out_Width 19 \
  CONFIG.Latency 1 \
  CONFIG.B_Value 000000000000000000 \
  CONFIG.CE false \
] [get_bd_cells c_addsub_39]
create_bd_cell -type ip -vlnv xilinx.com:ip:c_addsub:12.0 c_addsub_40
set_property -dict [list \
  CONFIG.A_Width 18 \
  CONFIG.B_Width 18 \
  CONFIG.Out_Width 19 \
  CONFIG.Latency 1 \
  CONFIG.B_Value 000000000000000000 \
  CONFIG.CE false \
] [get_bd_cells c_addsub_40]
create_bd_cell -type ip -vlnv xilinx.com:ip:c_addsub:12.0 c_addsub_41
set_property -dict [list \
  CONFIG.A_Width 18 \
  CONFIG.B_Width 18 \
  CONFIG.Out_Width 19 \
  CONFIG.Latency 1 \
  CONFIG.B_Value 000000000000000000 \
  CONFIG.CE false \
] [get_bd_cells c_addsub_41]
create_bd_cell -type ip -vlnv xilinx.com:ip:c_addsub:12.0 c_addsub_42
set_property -dict [list \
  CONFIG.A_Width 19 \
  CONFIG.B_Width 19 \
  CONFIG.Out_Width 20 \
  CONFIG.Latency 1 \
  CONFIG.B_Value 0000000000000000000 \
  CONFIG.CE false \
] [get_bd_cells c_addsub_42]
create_bd_cell -type ip -vlnv xilinx.com:ip:c_addsub:12.0 c_addsub_43
set_property -dict [list \
  CONFIG.A_Width 19 \
  CONFIG.B_Width 19 \
  CONFIG.Out_Width 20 \
  CONFIG.Latency 1 \
  CONFIG.B_Value 0000000000000000000 \
  CONFIG.CE false \
] [get_bd_cells c_addsub_43]
create_bd_cell -type ip -vlnv xilinx.com:ip:c_addsub:12.0 c_addsub_44
set_property -dict [list \
  CONFIG.A_Width 19 \
  CONFIG.B_Width 19 \
  CONFIG.Out_Width 20 \
  CONFIG.Latency 1 \
  CONFIG.B_Value 0000000000000000000 \
  CONFIG.CE false \
] [get_bd_cells c_addsub_44]
create_bd_cell -type ip -vlnv xilinx.com:ip:c_addsub:12.0 c_addsub_45
set_property -dict [list \
  CONFIG.A_Width 20 \
  CONFIG.B_Width 20 \
  CONFIG.Out_Width 21 \
  CONFIG.Latency 1 \
  CONFIG.B_Value 00000000000000000000 \
  CONFIG.CE false \
] [get_bd_cells c_addsub_45]
create_bd_cell -type ip -vlnv xilinx.com:ip:c_addsub:12.0 c_addsub_46
set_property -dict [list \
  CONFIG.A_Width 20 \
  CONFIG.B_Width 16 \
  CONFIG.Out_Width 21 \
  CONFIG.Latency 1 \
  CONFIG.B_Value 0000000000000000 \
  CONFIG.CE false \
] [get_bd_cells c_addsub_46]
create_bd_cell -type ip -vlnv xilinx.com:ip:c_addsub:12.0 c_addsub_47
set_property -dict [list \
  CONFIG.A_Width 21 \
  CONFIG.B_Width 21 \
  CONFIG.Out_Width 22 \
  CONFIG.Latency 1 \
  CONFIG.B_Value 000000000000000000000 \
  CONFIG.CE false \
] [get_bd_cells c_addsub_47]

# ---- connections ----

connect_bd_net [get_bd_pins mult_gen_0/P] [get_bd_pins c_addsub_0/A]
connect_bd_net [get_bd_pins mult_gen_1/P] [get_bd_pins c_addsub_0/B]
connect_bd_net [get_bd_pins mult_gen_2/P] [get_bd_pins c_addsub_23/A]
connect_bd_net [get_bd_pins mult_gen_3/P] [get_bd_pins c_addsub_23/B]
connect_bd_net [get_bd_pins mult_gen_5/P] [get_bd_pins c_addsub_22/A]
connect_bd_net [get_bd_pins mult_gen_4/P] [get_bd_pins c_addsub_22/B]
connect_bd_net [get_bd_pins mult_gen_6/P] [get_bd_pins c_addsub_21/A]
connect_bd_net [get_bd_pins mult_gen_7/P] [get_bd_pins c_addsub_21/B]
connect_bd_net [get_bd_pins mult_gen_8/P] [get_bd_pins c_addsub_20/A]
connect_bd_net [get_bd_pins mult_gen_9/P] [get_bd_pins c_addsub_20/B]
connect_bd_net [get_bd_pins mult_gen_10/P] [get_bd_pins c_addsub_19/A]
connect_bd_net [get_bd_pins mult_gen_11/P] [get_bd_pins c_addsub_19/B]
connect_bd_net [get_bd_pins mult_gen_13/P] [get_bd_pins c_addsub_18/A]
connect_bd_net [get_bd_pins mult_gen_12/P] [get_bd_pins c_addsub_18/B]
connect_bd_net [get_bd_pins mult_gen_15/P] [get_bd_pins c_addsub_17/A]
connect_bd_net [get_bd_pins mult_gen_14/P] [get_bd_pins c_addsub_17/B]
connect_bd_net [get_bd_pins mult_gen_16/P] [get_bd_pins c_addsub_16/A]
connect_bd_net [get_bd_pins mult_gen_17/P] [get_bd_pins c_addsub_16/B]
connect_bd_net [get_bd_pins mult_gen_18/P] [get_bd_pins c_addsub_15/A]
connect_bd_net [get_bd_pins mult_gen_19/P] [get_bd_pins c_addsub_15/B]
connect_bd_net [get_bd_pins mult_gen_20/P] [get_bd_pins c_addsub_14/A]
connect_bd_net [get_bd_pins mult_gen_21/P] [get_bd_pins c_addsub_14/B]
connect_bd_net [get_bd_pins mult_gen_22/P] [get_bd_pins c_addsub_13/A]
connect_bd_net [get_bd_pins mult_gen_23/P] [get_bd_pins c_addsub_13/B]
connect_bd_net [get_bd_pins mult_gen_24/P] [get_bd_pins c_addsub_12/A]
connect_bd_net [get_bd_pins mult_gen_25/P] [get_bd_pins c_addsub_12/B]
connect_bd_net [get_bd_pins mult_gen_26/P] [get_bd_pins c_addsub_11/A]
connect_bd_net [get_bd_pins mult_gen_27/P] [get_bd_pins c_addsub_11/B]
connect_bd_net [get_bd_pins mult_gen_28/P] [get_bd_pins c_addsub_10/A]
connect_bd_net [get_bd_pins mult_gen_29/P] [get_bd_pins c_addsub_10/B]
connect_bd_net [get_bd_pins mult_gen_30/P] [get_bd_pins c_addsub_9/A]
connect_bd_net [get_bd_pins mult_gen_31/P] [get_bd_pins c_addsub_9/B]
connect_bd_net [get_bd_pins mult_gen_32/P] [get_bd_pins c_addsub_8/A]
connect_bd_net [get_bd_pins mult_gen_33/P] [get_bd_pins c_addsub_8/B]
connect_bd_net [get_bd_pins mult_gen_34/P] [get_bd_pins c_addsub_7/A]
connect_bd_net [get_bd_pins mult_gen_35/P] [get_bd_pins c_addsub_7/B]
connect_bd_net [get_bd_pins mult_gen_36/P] [get_bd_pins c_addsub_6/A]
connect_bd_net [get_bd_pins mult_gen_37/P] [get_bd_pins c_addsub_6/B]
connect_bd_net [get_bd_pins mult_gen_38/P] [get_bd_pins c_addsub_5/A]
connect_bd_net [get_bd_pins mult_gen_39/P] [get_bd_pins c_addsub_5/B]
connect_bd_net [get_bd_pins mult_gen_40/P] [get_bd_pins c_addsub_4/A]
connect_bd_net [get_bd_pins mult_gen_41/P] [get_bd_pins c_addsub_4/B]
connect_bd_net [get_bd_pins mult_gen_42/P] [get_bd_pins c_addsub_3/A]
connect_bd_net [get_bd_pins mult_gen_43/P] [get_bd_pins c_addsub_3/B]
connect_bd_net [get_bd_pins mult_gen_44/P] [get_bd_pins c_addsub_1/A]
connect_bd_net [get_bd_pins mult_gen_45/P] [get_bd_pins c_addsub_1/B]
connect_bd_net [get_bd_pins mult_gen_46/P] [get_bd_pins c_addsub_2/A]
connect_bd_net [get_bd_pins mult_gen_47/P] [get_bd_pins c_addsub_2/B]
connect_bd_net [get_bd_pins c_addsub_0/S] [get_bd_pins c_addsub_28/A]
connect_bd_net [get_bd_pins c_addsub_23/S] [get_bd_pins c_addsub_28/B]
connect_bd_net [get_bd_pins c_addsub_22/S] [get_bd_pins c_addsub_27/A]
connect_bd_net [get_bd_pins c_addsub_21/S] [get_bd_pins c_addsub_27/B]
connect_bd_net [get_bd_pins c_addsub_20/S] [get_bd_pins c_addsub_26/A]
connect_bd_net [get_bd_pins c_addsub_19/S] [get_bd_pins c_addsub_26/B]
connect_bd_net [get_bd_pins c_addsub_18/S] [get_bd_pins c_addsub_25/A]
connect_bd_net [get_bd_pins c_addsub_17/S] [get_bd_pins c_addsub_25/B]
connect_bd_net [get_bd_pins c_addsub_16/S] [get_bd_pins c_addsub_31/A]
connect_bd_net [get_bd_pins c_addsub_15/S] [get_bd_pins c_addsub_31/B]
connect_bd_net [get_bd_pins c_addsub_14/S] [get_bd_pins c_addsub_29/A]
connect_bd_net [get_bd_pins c_addsub_13/S] [get_bd_pins c_addsub_29/B]
connect_bd_net [get_bd_pins c_addsub_12/S] [get_bd_pins c_addsub_24/A]
connect_bd_net [get_bd_pins c_addsub_11/S] [get_bd_pins c_addsub_24/B]
connect_bd_net [get_bd_pins c_addsub_10/S] [get_bd_pins c_addsub_30/A]
connect_bd_net [get_bd_pins c_addsub_9/S] [get_bd_pins c_addsub_30/B]
connect_bd_net [get_bd_pins c_addsub_8/S] [get_bd_pins c_addsub_33/A]
connect_bd_net [get_bd_pins c_addsub_7/S] [get_bd_pins c_addsub_33/B]
connect_bd_net [get_bd_pins c_addsub_6/S] [get_bd_pins c_addsub_32/A]
connect_bd_net [get_bd_pins c_addsub_5/S] [get_bd_pins c_addsub_32/B]
connect_bd_net [get_bd_pins c_addsub_4/S] [get_bd_pins c_addsub_34/A]
connect_bd_net [get_bd_pins c_addsub_3/S] [get_bd_pins c_addsub_34/B]
connect_bd_net [get_bd_pins c_addsub_1/S] [get_bd_pins c_addsub_35/A]
connect_bd_net [get_bd_pins c_addsub_2/S] [get_bd_pins c_addsub_35/B]
connect_bd_net [get_bd_pins c_addsub_28/S] [get_bd_pins c_addsub_37/A]
connect_bd_net [get_bd_pins c_addsub_27/S] [get_bd_pins c_addsub_37/B]
connect_bd_net [get_bd_pins c_addsub_26/S] [get_bd_pins c_addsub_38/A]
connect_bd_net [get_bd_pins c_addsub_25/S] [get_bd_pins c_addsub_38/B]
connect_bd_net [get_bd_pins c_addsub_31/S] [get_bd_pins c_addsub_39/A]
connect_bd_net [get_bd_pins c_addsub_29/S] [get_bd_pins c_addsub_39/B]
connect_bd_net [get_bd_pins c_addsub_24/S] [get_bd_pins c_addsub_40/A]
connect_bd_net [get_bd_pins c_addsub_30/S] [get_bd_pins c_addsub_40/B]
connect_bd_net [get_bd_pins c_addsub_33/S] [get_bd_pins c_addsub_41/A]
connect_bd_net [get_bd_pins c_addsub_32/S] [get_bd_pins c_addsub_41/B]
connect_bd_net [get_bd_pins c_addsub_34/S] [get_bd_pins c_addsub_36/A]
connect_bd_net [get_bd_pins c_addsub_35/S] [get_bd_pins c_addsub_36/B]
connect_bd_net [get_bd_pins c_addsub_37/S] [get_bd_pins c_addsub_42/A]
connect_bd_net [get_bd_pins c_addsub_38/S] [get_bd_pins c_addsub_42/B]
connect_bd_net [get_bd_pins c_addsub_39/S] [get_bd_pins c_addsub_43/A]
connect_bd_net [get_bd_pins c_addsub_40/S] [get_bd_pins c_addsub_43/B]
connect_bd_net [get_bd_pins c_addsub_41/S] [get_bd_pins c_addsub_44/A]
connect_bd_net [get_bd_pins c_addsub_36/S] [get_bd_pins c_addsub_44/B]
connect_bd_net [get_bd_pins c_addsub_42/S] [get_bd_pins c_addsub_45/A]
connect_bd_net [get_bd_pins c_addsub_43/S] [get_bd_pins c_addsub_45/B]
connect_bd_net [get_bd_pins c_addsub_44/S] [get_bd_pins c_addsub_46/A]
connect_bd_net [get_bd_pins mult_gen_48/P] [get_bd_pins c_addsub_46/B]
connect_bd_net [get_bd_pins c_addsub_45/S] [get_bd_pins c_addsub_47/A]
connect_bd_net [get_bd_pins c_addsub_46/S] [get_bd_pins c_addsub_47/B]
connect_bd_net [get_bd_ports A] [get_bd_pins mult_gen_0/A]
connect_bd_net [get_bd_ports B] [get_bd_pins mult_gen_0/B]
connect_bd_net -net A_1_1 [get_bd_ports A_1] [get_bd_pins mult_gen_1/A]
connect_bd_net -net B_1_1 [get_bd_ports B_1] [get_bd_pins mult_gen_1/B]
connect_bd_net -net A_2_1 [get_bd_ports A_2] [get_bd_pins mult_gen_2/A]
connect_bd_net -net B_2_1 [get_bd_ports B_2] [get_bd_pins mult_gen_2/B]
connect_bd_net -net A_3_1 [get_bd_ports A_3] [get_bd_pins mult_gen_3/A]
connect_bd_net -net B_3_1 [get_bd_ports B_3] [get_bd_pins mult_gen_3/B]
connect_bd_net -net A_4_1 [get_bd_ports A_4] [get_bd_pins mult_gen_5/A]
connect_bd_net -net B_4_1 [get_bd_ports B_4] [get_bd_pins mult_gen_5/B]
connect_bd_net -net A_5_1 [get_bd_ports A_5] [get_bd_pins mult_gen_4/A]
connect_bd_net -net B_5_1 [get_bd_ports B_5] [get_bd_pins mult_gen_4/B]
connect_bd_net -net A_6_1 [get_bd_ports A_6] [get_bd_pins mult_gen_6/A]
connect_bd_net -net B_6_1 [get_bd_ports B_6] [get_bd_pins mult_gen_6/B]
connect_bd_net -net A_7_1 [get_bd_ports A_7] [get_bd_pins mult_gen_7/A]
connect_bd_net -net B_7_1 [get_bd_ports B_7] [get_bd_pins mult_gen_7/B]
connect_bd_net -net A_8_1 [get_bd_ports A_8] [get_bd_pins mult_gen_8/A]
connect_bd_net -net B_8_1 [get_bd_ports B_8] [get_bd_pins mult_gen_8/B]
connect_bd_net -net A_9_1 [get_bd_ports A_9] [get_bd_pins mult_gen_9/A]
connect_bd_net -net B_9_1 [get_bd_ports B_9] [get_bd_pins mult_gen_9/B]
connect_bd_net -net A_10_1 [get_bd_ports A_10] [get_bd_pins mult_gen_10/A]
connect_bd_net -net B_10_1 [get_bd_ports B_10] [get_bd_pins mult_gen_10/B]
connect_bd_net -net A_11_1 [get_bd_ports A_11] [get_bd_pins mult_gen_11/A]
connect_bd_net -net B_11_1 [get_bd_ports B_11] [get_bd_pins mult_gen_11/B]
connect_bd_net -net A_12_1 [get_bd_ports A_12] [get_bd_pins mult_gen_13/A]
connect_bd_net -net B_12_1 [get_bd_ports B_12] [get_bd_pins mult_gen_13/B]
connect_bd_net -net A_13_1 [get_bd_ports A_13] [get_bd_pins mult_gen_12/A]
connect_bd_net -net B_13_1 [get_bd_ports B_13] [get_bd_pins mult_gen_12/B]
connect_bd_net -net A_14_1 [get_bd_ports A_14] [get_bd_pins mult_gen_15/A]
connect_bd_net -net B_14_1 [get_bd_ports B_14] [get_bd_pins mult_gen_15/B]
connect_bd_net -net A_15_1 [get_bd_ports A_15] [get_bd_pins mult_gen_14/A]
connect_bd_net -net B_15_1 [get_bd_ports B_15] [get_bd_pins mult_gen_14/B]
connect_bd_net -net A_16_1 [get_bd_ports A_16] [get_bd_pins mult_gen_16/A]
connect_bd_net -net B_16_1 [get_bd_ports B_16] [get_bd_pins mult_gen_16/B]
connect_bd_net -net A_17_1 [get_bd_ports A_17] [get_bd_pins mult_gen_17/A]
connect_bd_net -net B_17_1 [get_bd_ports B_17] [get_bd_pins mult_gen_17/B]
connect_bd_net -net A_18_1 [get_bd_ports A_18] [get_bd_pins mult_gen_18/A]
connect_bd_net -net B_18_1 [get_bd_ports B_18] [get_bd_pins mult_gen_18/B]
connect_bd_net -net A_19_1 [get_bd_ports A_19] [get_bd_pins mult_gen_19/A]
connect_bd_net -net B_19_1 [get_bd_ports B_19] [get_bd_pins mult_gen_19/B]
connect_bd_net -net A_20_1 [get_bd_ports A_20] [get_bd_pins mult_gen_20/A]
connect_bd_net -net B_20_1 [get_bd_ports B_20] [get_bd_pins mult_gen_20/B]
connect_bd_net -net A_21_1 [get_bd_ports A_21] [get_bd_pins mult_gen_21/A]
connect_bd_net -net B_21_1 [get_bd_ports B_21] [get_bd_pins mult_gen_21/B]
connect_bd_net -net A_22_1 [get_bd_ports A_22] [get_bd_pins mult_gen_22/A]
connect_bd_net -net B_22_1 [get_bd_ports B_22] [get_bd_pins mult_gen_22/B]
connect_bd_net -net A_23_1 [get_bd_ports A_23] [get_bd_pins mult_gen_23/A]
connect_bd_net -net B_23_1 [get_bd_ports B_23] [get_bd_pins mult_gen_23/B]
connect_bd_net -net A_24_1 [get_bd_ports A_24] [get_bd_pins mult_gen_24/A]
connect_bd_net -net B_24_1 [get_bd_ports B_24] [get_bd_pins mult_gen_24/B]
connect_bd_net -net A_25_1 [get_bd_ports A_25] [get_bd_pins mult_gen_25/A]
connect_bd_net -net B_25_1 [get_bd_ports B_25] [get_bd_pins mult_gen_25/B]
connect_bd_net -net A_26_1 [get_bd_ports A_26] [get_bd_pins mult_gen_26/A]
connect_bd_net -net B_26_1 [get_bd_ports B_26] [get_bd_pins mult_gen_26/B]
connect_bd_net -net A_27_1 [get_bd_ports A_27] [get_bd_pins mult_gen_27/A]
connect_bd_net -net B_27_1 [get_bd_ports B_27] [get_bd_pins mult_gen_27/B]
connect_bd_net -net A_28_1 [get_bd_ports A_28] [get_bd_pins mult_gen_28/A]
connect_bd_net -net B_28_1 [get_bd_ports B_28] [get_bd_pins mult_gen_28/B]
connect_bd_net -net A_29_1 [get_bd_ports A_29] [get_bd_pins mult_gen_29/A]
connect_bd_net -net B_29_1 [get_bd_ports B_29] [get_bd_pins mult_gen_29/B]
connect_bd_net -net A_30_1 [get_bd_ports A_30] [get_bd_pins mult_gen_30/A]
connect_bd_net -net B_30_1 [get_bd_ports B_30] [get_bd_pins mult_gen_30/B]
connect_bd_net -net A_31_1 [get_bd_ports A_31] [get_bd_pins mult_gen_31/A]
connect_bd_net -net B_31_1 [get_bd_ports B_31] [get_bd_pins mult_gen_31/B]
connect_bd_net -net A_32_1 [get_bd_ports A_32] [get_bd_pins mult_gen_32/A]
connect_bd_net -net B_32_1 [get_bd_ports B_32] [get_bd_pins mult_gen_32/B]
connect_bd_net -net A_33_1 [get_bd_ports A_33] [get_bd_pins mult_gen_33/A]
connect_bd_net -net B_33_1 [get_bd_ports B_33] [get_bd_pins mult_gen_33/B]
connect_bd_net -net A_34_1 [get_bd_ports A_34] [get_bd_pins mult_gen_34/A]
connect_bd_net -net B_34_1 [get_bd_ports B_34] [get_bd_pins mult_gen_34/B]
connect_bd_net -net A_35_1 [get_bd_ports A_35] [get_bd_pins mult_gen_35/A]
connect_bd_net -net B_35_1 [get_bd_ports B_35] [get_bd_pins mult_gen_35/B]
connect_bd_net -net A_36_1 [get_bd_ports A_36] [get_bd_pins mult_gen_36/A]
connect_bd_net -net B_36_1 [get_bd_ports B_36] [get_bd_pins mult_gen_36/B]
connect_bd_net -net A_37_1 [get_bd_ports A_37] [get_bd_pins mult_gen_37/A]
connect_bd_net -net B_37_1 [get_bd_ports B_37] [get_bd_pins mult_gen_37/B]
connect_bd_net -net A_38_1 [get_bd_ports A_38] [get_bd_pins mult_gen_38/A]
connect_bd_net -net B_38_1 [get_bd_ports B_38] [get_bd_pins mult_gen_38/B]
connect_bd_net -net A_39_1 [get_bd_ports A_39] [get_bd_pins mult_gen_39/A]
connect_bd_net -net B_39_1 [get_bd_ports B_39] [get_bd_pins mult_gen_39/B]
connect_bd_net -net A_40_1 [get_bd_ports A_40] [get_bd_pins mult_gen_40/A]
connect_bd_net -net B_40_1 [get_bd_ports B_40] [get_bd_pins mult_gen_40/B]
connect_bd_net -net A_41_1 [get_bd_ports A_41] [get_bd_pins mult_gen_41/A]
connect_bd_net -net B_41_1 [get_bd_ports B_41] [get_bd_pins mult_gen_41/B]
connect_bd_net -net A_42_1 [get_bd_ports A_42] [get_bd_pins mult_gen_42/A]
connect_bd_net -net B_42_1 [get_bd_ports B_42] [get_bd_pins mult_gen_42/B]
connect_bd_net -net A_43_1 [get_bd_ports A_43] [get_bd_pins mult_gen_43/A]
connect_bd_net -net B_43_1 [get_bd_ports B_43] [get_bd_pins mult_gen_43/B]
connect_bd_net -net A_44_1 [get_bd_ports A_44] [get_bd_pins mult_gen_44/A]
connect_bd_net -net B_44_1 [get_bd_ports B_44] [get_bd_pins mult_gen_44/B]
connect_bd_net -net A_45_1 [get_bd_ports A_45] [get_bd_pins mult_gen_45/A]
connect_bd_net -net B_45_1 [get_bd_ports B_45] [get_bd_pins mult_gen_45/B]
connect_bd_net -net A_46_1 [get_bd_ports A_46] [get_bd_pins mult_gen_46/A]
connect_bd_net -net B_46_1 [get_bd_ports B_46] [get_bd_pins mult_gen_46/B]
connect_bd_net -net A_47_1 [get_bd_ports A_47] [get_bd_pins mult_gen_48/A]
connect_bd_net -net B_47_1 [get_bd_ports B_47] [get_bd_pins mult_gen_48/B]
connect_bd_net [get_bd_pins c_addsub_47/S] [get_bd_ports S]
connect_bd_net [get_bd_ports CLK] \
  [get_bd_pins c_addsub_35/CLK] [get_bd_pins c_addsub_2/CLK] [get_bd_pins c_addsub_1/CLK] [get_bd_pins c_addsub_3/CLK] \
  [get_bd_pins c_addsub_34/CLK] [get_bd_pins c_addsub_4/CLK] [get_bd_pins c_addsub_32/CLK] [get_bd_pins c_addsub_5/CLK] \
  [get_bd_pins c_addsub_6/CLK] [get_bd_pins c_addsub_33/CLK] [get_bd_pins c_addsub_7/CLK] [get_bd_pins c_addsub_8/CLK] \
  [get_bd_pins c_addsub_30/CLK] [get_bd_pins c_addsub_9/CLK] [get_bd_pins c_addsub_10/CLK] [get_bd_pins c_addsub_24/CLK] \
  [get_bd_pins c_addsub_11/CLK] [get_bd_pins c_addsub_12/CLK] [get_bd_pins c_addsub_29/CLK] [get_bd_pins c_addsub_13/CLK] \
  [get_bd_pins c_addsub_14/CLK] [get_bd_pins c_addsub_31/CLK] [get_bd_pins c_addsub_16/CLK] [get_bd_pins c_addsub_15/CLK] \
  [get_bd_pins c_addsub_17/CLK] [get_bd_pins c_addsub_18/CLK] [get_bd_pins c_addsub_19/CLK] [get_bd_pins c_addsub_26/CLK] \
  [get_bd_pins c_addsub_25/CLK] [get_bd_pins c_addsub_20/CLK] [get_bd_pins c_addsub_27/CLK] [get_bd_pins c_addsub_21/CLK] \
  [get_bd_pins c_addsub_22/CLK] [get_bd_pins c_addsub_28/CLK] [get_bd_pins c_addsub_23/CLK] [get_bd_pins c_addsub_0/CLK] \
  [get_bd_pins mult_gen_0/CLK] [get_bd_pins mult_gen_1/CLK] [get_bd_pins mult_gen_2/CLK] [get_bd_pins mult_gen_3/CLK] \
  [get_bd_pins mult_gen_5/CLK] [get_bd_pins mult_gen_4/CLK] [get_bd_pins mult_gen_6/CLK] [get_bd_pins mult_gen_7/CLK] \
  [get_bd_pins mult_gen_8/CLK] [get_bd_pins mult_gen_9/CLK] [get_bd_pins mult_gen_10/CLK] [get_bd_pins mult_gen_11/CLK] \
  [get_bd_pins mult_gen_13/CLK] [get_bd_pins mult_gen_12/CLK] [get_bd_pins mult_gen_15/CLK] [get_bd_pins mult_gen_14/CLK] \
  [get_bd_pins mult_gen_16/CLK] [get_bd_pins mult_gen_17/CLK] [get_bd_pins mult_gen_18/CLK] [get_bd_pins mult_gen_19/CLK] \
  [get_bd_pins mult_gen_20/CLK] [get_bd_pins mult_gen_21/CLK] [get_bd_pins mult_gen_22/CLK] [get_bd_pins mult_gen_23/CLK] \
  [get_bd_pins mult_gen_24/CLK] [get_bd_pins mult_gen_25/CLK] [get_bd_pins mult_gen_26/CLK] [get_bd_pins mult_gen_27/CLK] \
  [get_bd_pins mult_gen_28/CLK] [get_bd_pins mult_gen_29/CLK] [get_bd_pins mult_gen_30/CLK] [get_bd_pins mult_gen_31/CLK] \
  [get_bd_pins mult_gen_32/CLK] [get_bd_pins mult_gen_33/CLK] [get_bd_pins mult_gen_34/CLK] [get_bd_pins mult_gen_35/CLK] \
  [get_bd_pins mult_gen_36/CLK] [get_bd_pins mult_gen_37/CLK] [get_bd_pins mult_gen_38/CLK] [get_bd_pins mult_gen_39/CLK] \
  [get_bd_pins mult_gen_44/CLK] [get_bd_pins mult_gen_40/CLK] [get_bd_pins mult_gen_42/CLK] [get_bd_pins mult_gen_46/CLK] \
  [get_bd_pins mult_gen_48/CLK] [get_bd_pins mult_gen_41/CLK] [get_bd_pins mult_gen_43/CLK] [get_bd_pins mult_gen_45/CLK] \
  [get_bd_pins mult_gen_47/CLK] [get_bd_pins c_addsub_37/CLK] [get_bd_pins c_addsub_38/CLK] [get_bd_pins c_addsub_39/CLK] \
  [get_bd_pins c_addsub_40/CLK] [get_bd_pins c_addsub_41/CLK] [get_bd_pins c_addsub_36/CLK] [get_bd_pins c_addsub_42/CLK] \
  [get_bd_pins c_addsub_43/CLK] [get_bd_pins c_addsub_44/CLK] [get_bd_pins c_addsub_45/CLK] [get_bd_pins c_addsub_46/CLK] \
  [get_bd_pins c_addsub_47/CLK]
connect_bd_net -net A_48_1 [get_bd_ports A_48] [get_bd_pins mult_gen_47/A]
connect_bd_net -net B_48_1 [get_bd_ports B_48] [get_bd_pins mult_gen_47/B]

validate_bd_design
save_bd_design
